# EAGLE design hail (EAGLE 6.6.0)
AUTHOR: Branden Ghena; REV: A; TITLE: Hail

## Sheet 1 of 4
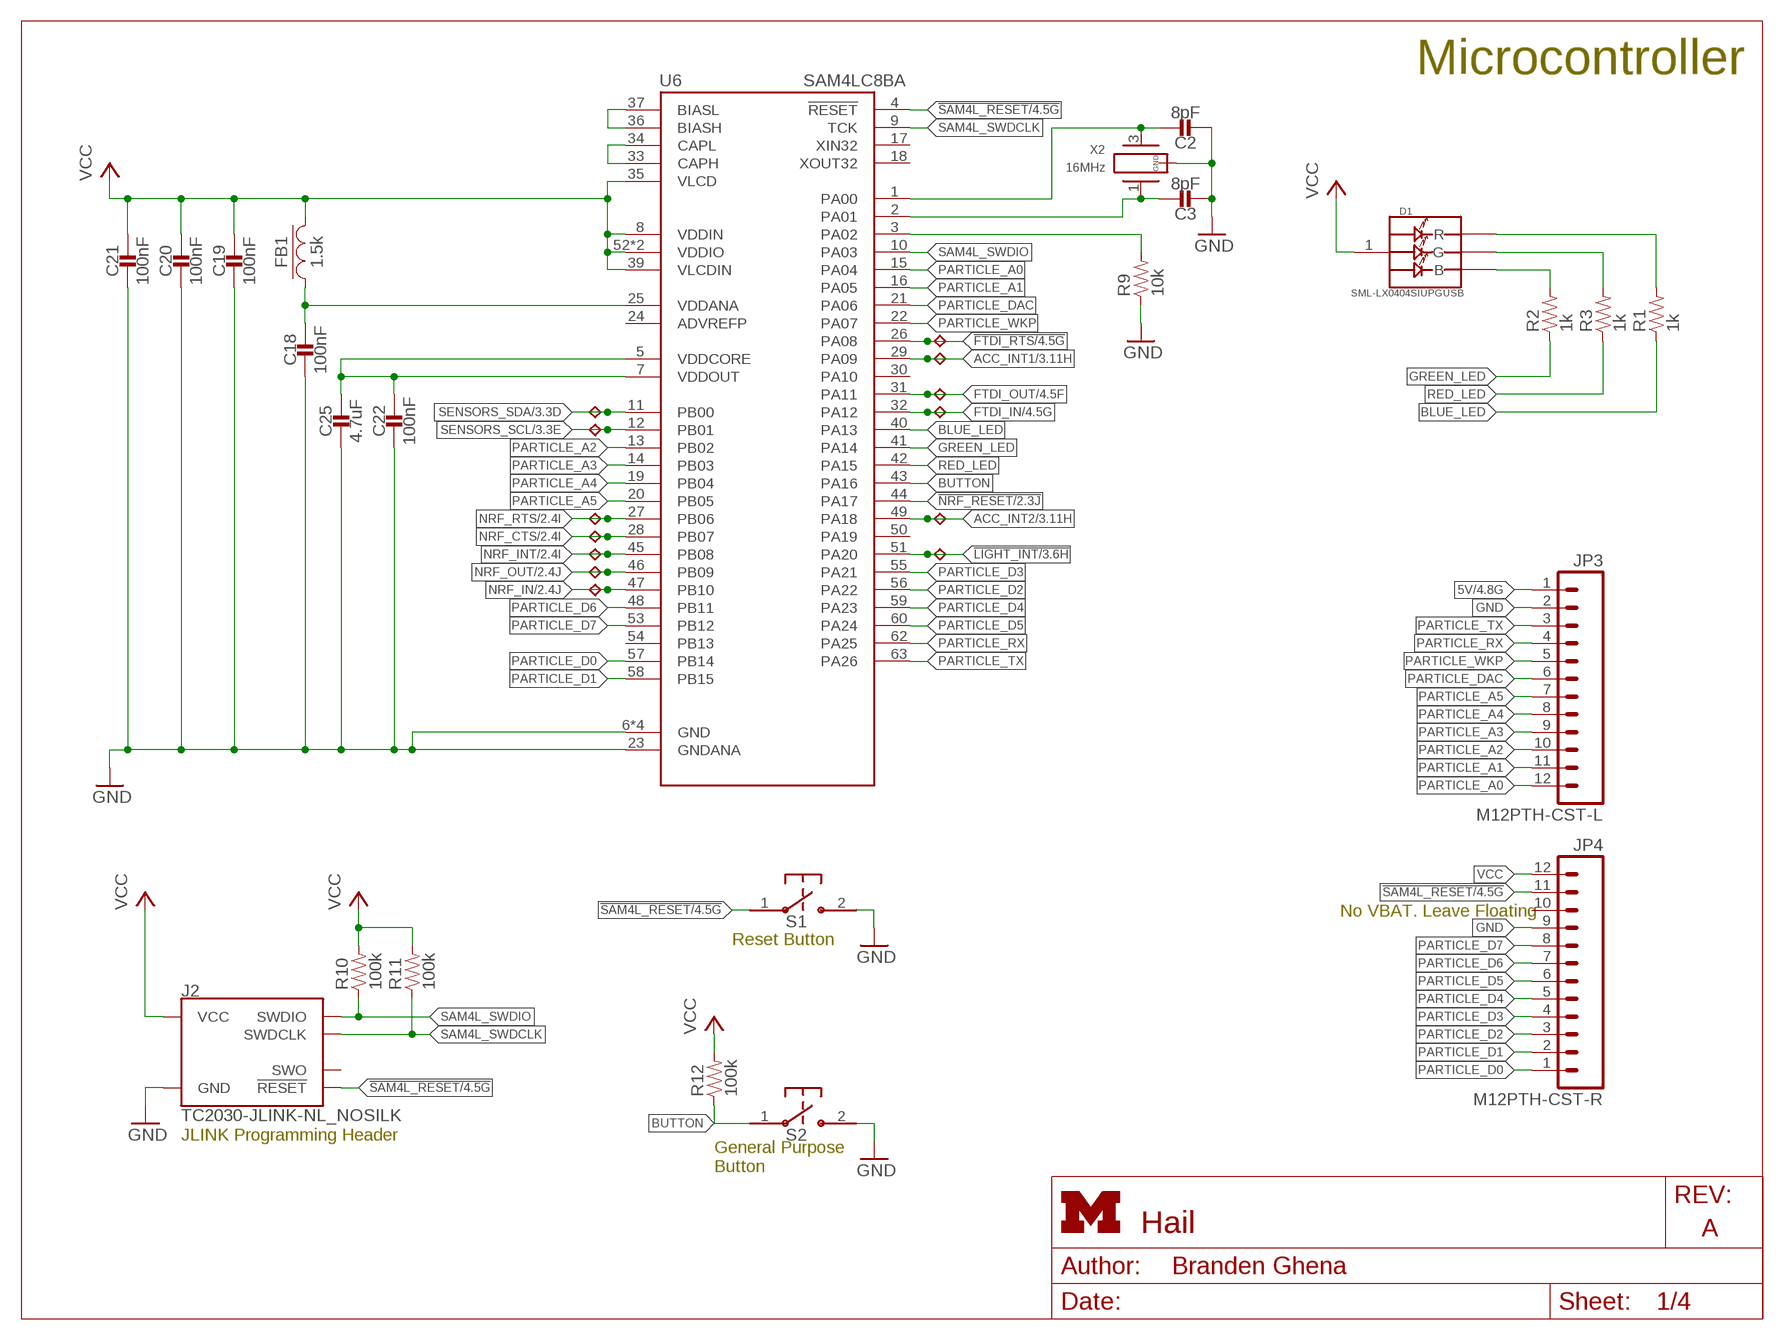
[diagram p0: schematic, sheet 1]
FRAME4 (LETTER_L_UMICH): HEIGHT: 8.5in; WIDTH: 11in
FRAME5 (LETTER_L_UMICH): HEIGHT: 8.5in; WIDTH: 11in

### Parts
C2  8pF  CAPACITOR0402_CAP  [0402_CAP]
C3  8pF  CAPACITOR0402_CAP  [0402_CAP]
C18  100nF  CAPACITOR0402_CAP  [0402_CAP]
C19  100nF  CAPACITOR0402_CAP  [0402_CAP]
C20  100nF  CAPACITOR0402_CAP  [0402_CAP]
C21  100nF  CAPACITOR0402_CAP  [0402_CAP]
C22  100nF  CAPACITOR0402_CAP  [0402_CAP]
C25  4.7uF  CAPACITOR0402_CAP  [0402_CAP]
D1  SML-LX0404SIUPGUSB  [1MM_SQ_4PAD]
FB1  1.5k  FERRITE_BEAD0402  [0402_CAP]
J2  TC2030-JLINK-NL_NOSILK  [TC2030-IDC-NL_NOSILK]
JP3  M12PTH-CST-L  [1X12-CASTELLATED]
JP4  M12PTH-CST-R  [1X12-CASTELLATED]
R1  1k  RESISTOR0402_RES  [0402_RES]
R2  1k  RESISTOR0402_RES  [0402_RES]
R3  1k  RESISTOR0402_RES  [0402_RES]
R9  10k  RESISTOR0402_RES  [0402_RES]
R10  100k  RESISTOR0402_RES  [0402_RES]
R11  100k  RESISTOR0402_RES  [0402_RES]
R12  100k  RESISTOR0402_RES  [0402_RES]
S1  B3U-1000P  [B3U-1000P]
S2  B3U-1000P  [B3U-1000P]
TP1  TPB1,27  [B1,27]
TP2  TPB1,27  [B1,27]
TP3  TPB1,27  [B1,27]
TP4  TPB1,27  [B1,27]
TP5  TPB1,27  [B1,27]
TP6  TPB1,27  [B1,27]
TP7  TPB1,27  [B1,27]
TP8  TPB1,27  [B1,27]
TP9  TPB1,27  [B1,27]
TP10  TPB1,27  [B1,27]
TP11  TPB1,27  [B1,27]
TP12  TPB1,27  [B1,27]
TP13  TPB1,27  [B1,27]
U6  SAM4LC8BA  [QFN-64-9MM]
X2  16MHz  FH1600015  [FHXXX]

### Nets
5V: JP3.1 ; also sheet 4
!FTDI_RTS: TP11.TP U6.26(PA08) ; also sheet 4
!LIGHT_INT: TP10.TP U6.51(PA20) ; also sheet 3
!NRF_RESET: U6.44(PA17) ; also sheet 2
!SAM4L_RESET: J2.3(!RESET) JP4.11 S1.1 U6.4(!RESET) ; also sheet 4
ACC_INT1: TP8.TP U6.29(PA09) ; also sheet 3
ACC_INT2: TP9.TP U6.49(PA18) ; also sheet 3
BLUE_LED: R1.1 U6.40(PA13)
BUCK/LDO_N1: R9.2 U6.3(PA02)
BUTTON: R12.1 S2.1 U6.43(PA16)
FTDI_IN: TP13.TP U6.32(PA12) ; also sheet 4
FTDI_OUT: TP12.TP U6.31(PA11) ; also sheet 4
GND: C2.2 C3.2 C18.2 C19.2 C20.2 C21.2 C22.2 C25.2 J2.5(GND) JP3.2 JP4.9 R9.1 S1.2 S2.2 U6.6(GND) U6.23(GNDANA) U6.38(GND) U6.64(GND) U6.GND X2.2(GND) X2.4(GND) ; also sheet 2,3,4
GREEN_LED: R2.1 U6.41(PA14)
N$7: D1.3(B) R2.2
N$8: D1.4(G) R3.2
N$9: D1.2(R) R1.2
N$15: U6.36(BIASH) U6.37(BIASL)
N$18: U6.33(CAPH) U6.34(CAPL)
N$20: C18.1 FB1.1 U6.25(VDDANA)
N$22: C22.1 C25.1 U6.5(VDDCORE) U6.7(VDDOUT)
NRF_CTS: TP2.TP U6.28(PB07) ; also sheet 2
NRF_IN: TP5.TP U6.47(PB10) ; also sheet 2
NRF_INT: TP3.TP U6.45(PB08) ; also sheet 2
NRF_OUT: TP4.TP U6.46(PB09) ; also sheet 2
NRF_RTS: TP1.TP U6.27(PB06) ; also sheet 2
PARTICLE_A0: JP3.12 U6.15(PA04)
PARTICLE_A1: JP3.11 U6.16(PA05)
PARTICLE_A2: JP3.10 U6.13(PB02)
PARTICLE_A3: JP3.9 U6.14(PB03)
PARTICLE_A4: JP3.8 U6.19(PB04)
PARTICLE_A5: JP3.7 U6.20(PB05)
PARTICLE_D0: JP4.1 U6.57(PB14)
PARTICLE_D1: JP4.2 U6.58(PB15)
PARTICLE_D2: JP4.3 U6.56(PA22)
PARTICLE_D3: JP4.4 U6.55(PA21)
PARTICLE_D4: JP4.5 U6.59(PA23)
PARTICLE_D5: JP4.6 U6.60(PA24)
PARTICLE_D6: JP4.7 U6.48(PB11)
PARTICLE_D7: JP4.8 U6.53(PB12)
PARTICLE_DAC: JP3.6 U6.21(PA06)
PARTICLE_RX: JP3.4 U6.62(PA25)
PARTICLE_TX: JP3.3 U6.63(PA26)
PARTICLE_WKP: JP3.5 U6.22(PA07)
RED_LED: R3.1 U6.42(PA15)
SAM4L_SWDCLK: J2.4(SWDCLK) R11.1 U6.9(TCK)
SAM4L_SWDIO: J2.2(SWDIO) R10.1 U6.10(PA03)
SAM4L_XIN1: C2.1 U6.1(PA00) X2.3
SAM4L_XOUT1: C3.1 U6.2(PA01) X2.1
SENSORS_SCL: TP7.TP U6.12(PB01) ; also sheet 3
SENSORS_SDA: TP6.TP U6.11(PB00) ; also sheet 3
VCC: C19.1 C20.1 C21.1 D1.1(VDD) FB1.2 J2.1(VCC) JP4.12 R10.2 R11.2 R12.2 U6.8(VDDIN) U6.35(VLCD) U6.39(VLCDIN) U6.52(VDDIO) U6.61(VDDIO) ; also sheet 2,3,4
Unconnected: J2.6(SWO) JP4.10 U6.17(XIN32) U6.18(XOUT32) U6.30(PA10) U6.50(PA19) U6.54(PB13)

### Notes on the sheet
- Microcontroller
- No VBAT. Leave Floating
- Reset Button
- JLINK Programming Header
- General Purpose
  Button

## Sheet 2 of 4
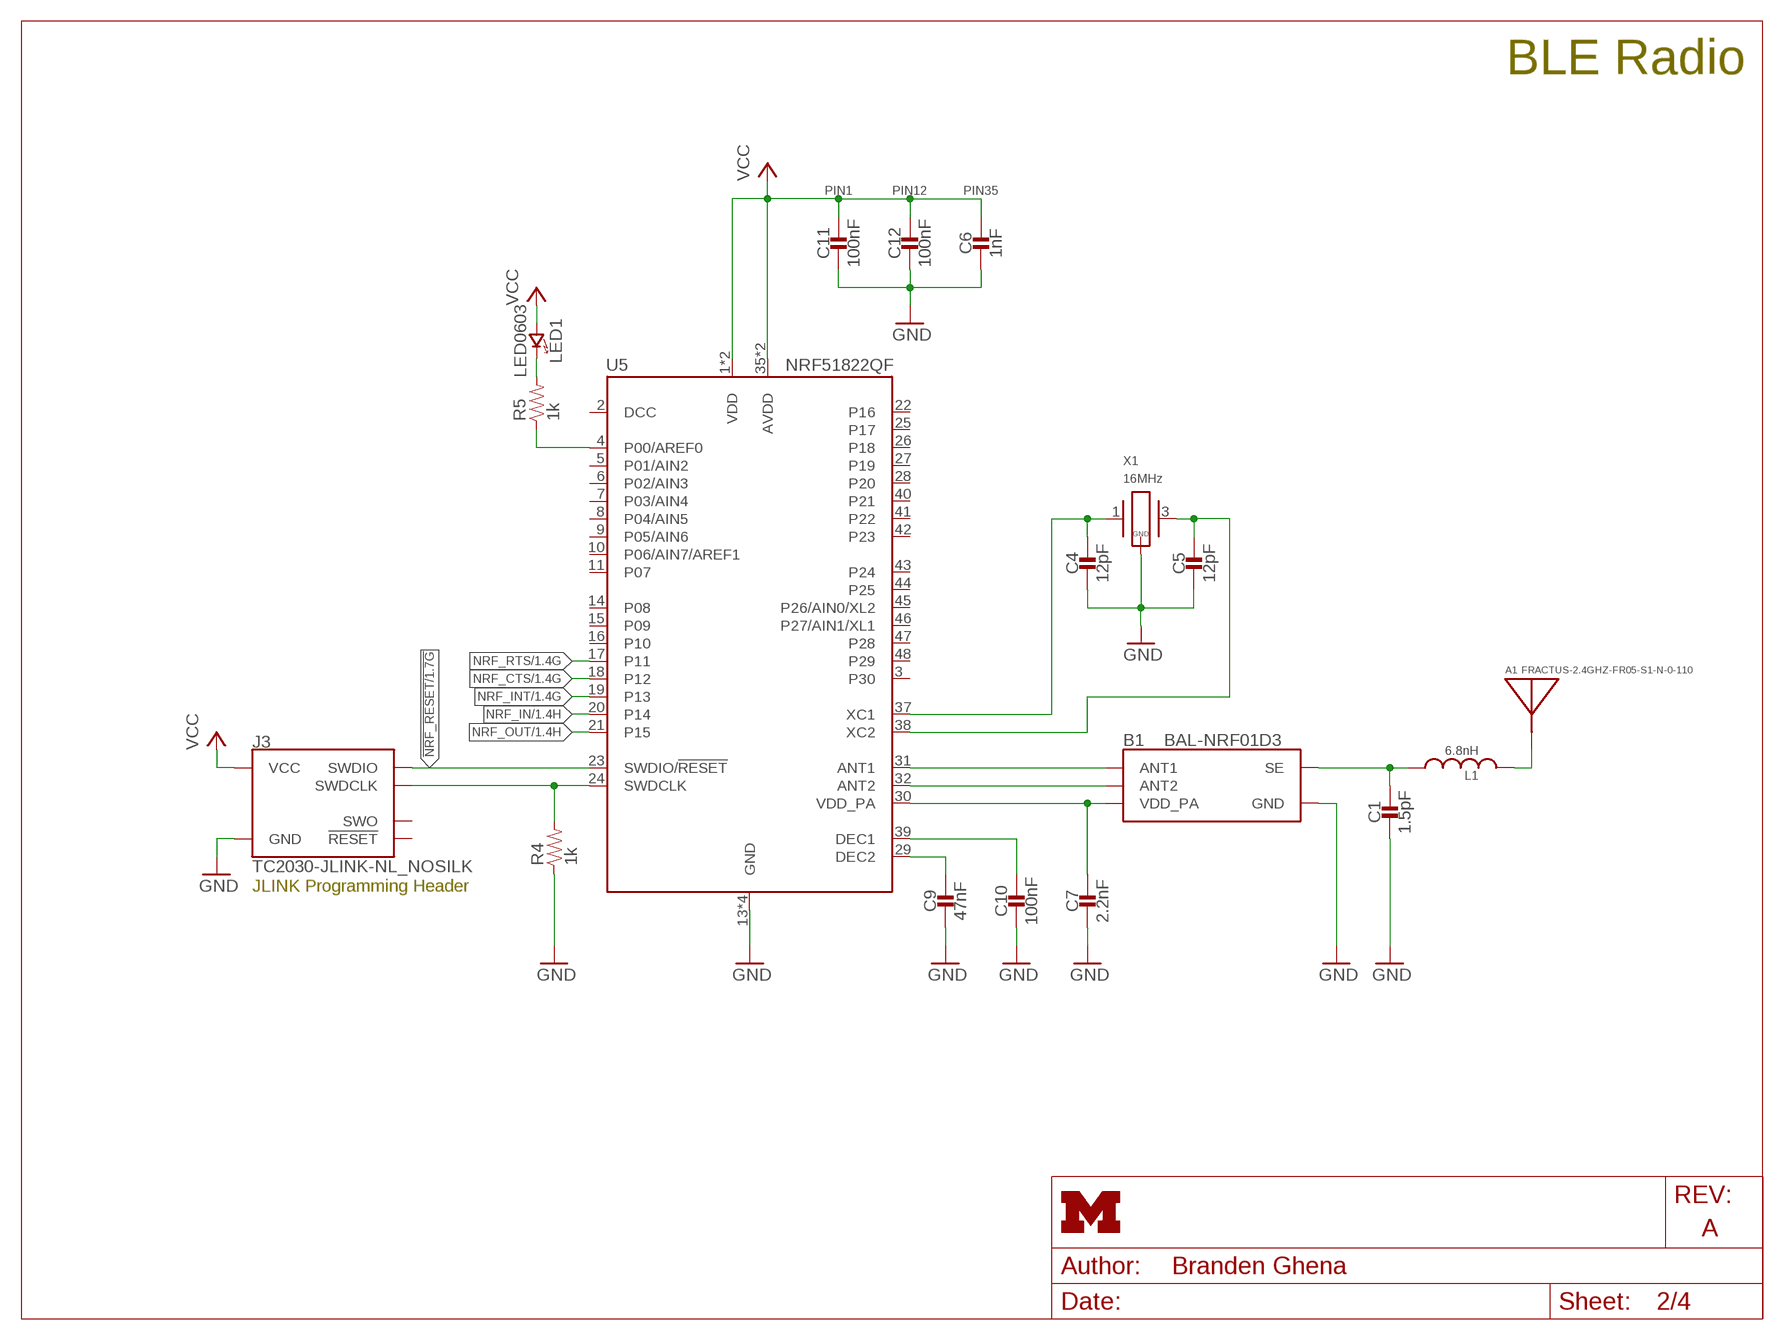
[diagram p1: schematic, sheet 2]
FRAME2 (LETTER_L_UMICH): HEIGHT: 8.5in; WIDTH: 11in
FRAME3 (LETTER_L_UMICH): HEIGHT: 8.5in; TITLE: Hail; WIDTH: 11in

### Parts
A1  FRACTUS-2.4GHZ-FR05-S1-N-0-110  [FRACTUS-ANTENNA-FR05-S1-N-0-110]
B1  BAL-NRF01D3  [BAL-NRF01D3]
C1  1.5pF  CAPACITOR0402_CAP  [0402_CAP]
C4  12pF  CAPACITOR0402_CAP  [0402_CAP]
C5  12pF  CAPACITOR0402_CAP  [0402_CAP]
C6  1nF  CAPACITOR0402_CAP  [0402_CAP]
C7  2.2nF  CAPACITOR0402_CAP  [0402_CAP]
C9  47nF  CAPACITOR0402_CAP  [0402_CAP]
C10  100nF  CAPACITOR0402_CAP  [0402_CAP]
C11  100nF  CAPACITOR0402_CAP  [0402_CAP]
C12  100nF  CAPACITOR0402_CAP  [0402_CAP]
J3  TC2030-JLINK-NL_NOSILK  [TC2030-IDC-NL_NOSILK]
L1  6.8nH  INDUCTOR0402  [0402_CAP]
LED1  LED0603  [LED-0603]
R4  1k  RESISTOR0402_RES  [0402_RES]
R5  1k  RESISTOR0402_RES  [0402_RES]
U5  NRF51822QF  [QFN-48-6MM]
X1  16MHz  TXC-8Y  [TXC-8Y]

### Nets
!NRF_RESET: J3.2(SWDIO) U5.23(SWDIO/!RESET) ; also sheet 1
GND: B1.GND C1.2 C4.2 C5.2 C6.2 C7.2 C9.2 C10.2 C11.2 C12.2 J3.5(GND) R4.1 U5.13(GND) U5.33(GND) U5.34(GND) U5.GND X1.2(GND) X1.4(GND) ; also sheet 1,3,4
N$3: C10.1 U5.39(DEC1)
N$4: C9.1 U5.29(DEC2)
N$6: J3.4(SWDCLK) R4.2 U5.24(SWDCLK)
N$10: R5.1 U5.4(P00/AREF0)
N$11: LED1.C(CATHODE) R5.2
N$12: B1.ANT1 U5.31(ANT1)
N$13: B1.VCC(VDD_PA) C7.1 U5.30(VDD_PA)
N$14: B1.ANT2 U5.32(ANT2)
N$16: C4.1 U5.37(XC1) X1.1
N$17: C5.1 U5.38(XC2) X1.3
N$19: B1.SE C1.1 L1.1
N$21: A1.ANT(ANTENNA) L1.2
NRF_CTS: U5.18(P12) ; also sheet 1
NRF_IN: U5.20(P14) ; also sheet 1
NRF_INT: U5.19(P13) ; also sheet 1
NRF_OUT: U5.21(P15) ; also sheet 1
NRF_RTS: U5.17(P11) ; also sheet 1
VCC: C6.1 C11.1 C12.1 J3.1(VCC) LED1.A(ANODE) U5.1(VDD) U5.12(VDD) U5.35(AVDD) U5.36(AVDD) ; also sheet 1,3,4
Unconnected: J3.3(!RESET) J3.6(SWO) U5.2(DCC) U5.3(P30) U5.5(P01/AIN2) U5.6(P02/AIN3) U5.7(P03/AIN4) U5.8(P04/AIN5) U5.9(P05/AIN6) U5.10(P06/AIN7/AREF1) U5.11(P07) U5.14(P08) U5.15(P09) U5.16(P10) U5.22(P16) U5.25(P17) U5.26(P18) U5.27(P19) U5.28(P20) U5.40(P21) U5.41(P22) U5.42(P23) U5.43(P24) U5.44(P25) U5.45(P26/AIN0/XL2) U5.46(P27/AIN1/XL1) U5.47(P28) U5.48(P29)

### Notes on the sheet
- BLE Radio
- PIN1 | PIN12 | PIN35
- JLINK Programming Header

## Sheet 3 of 4
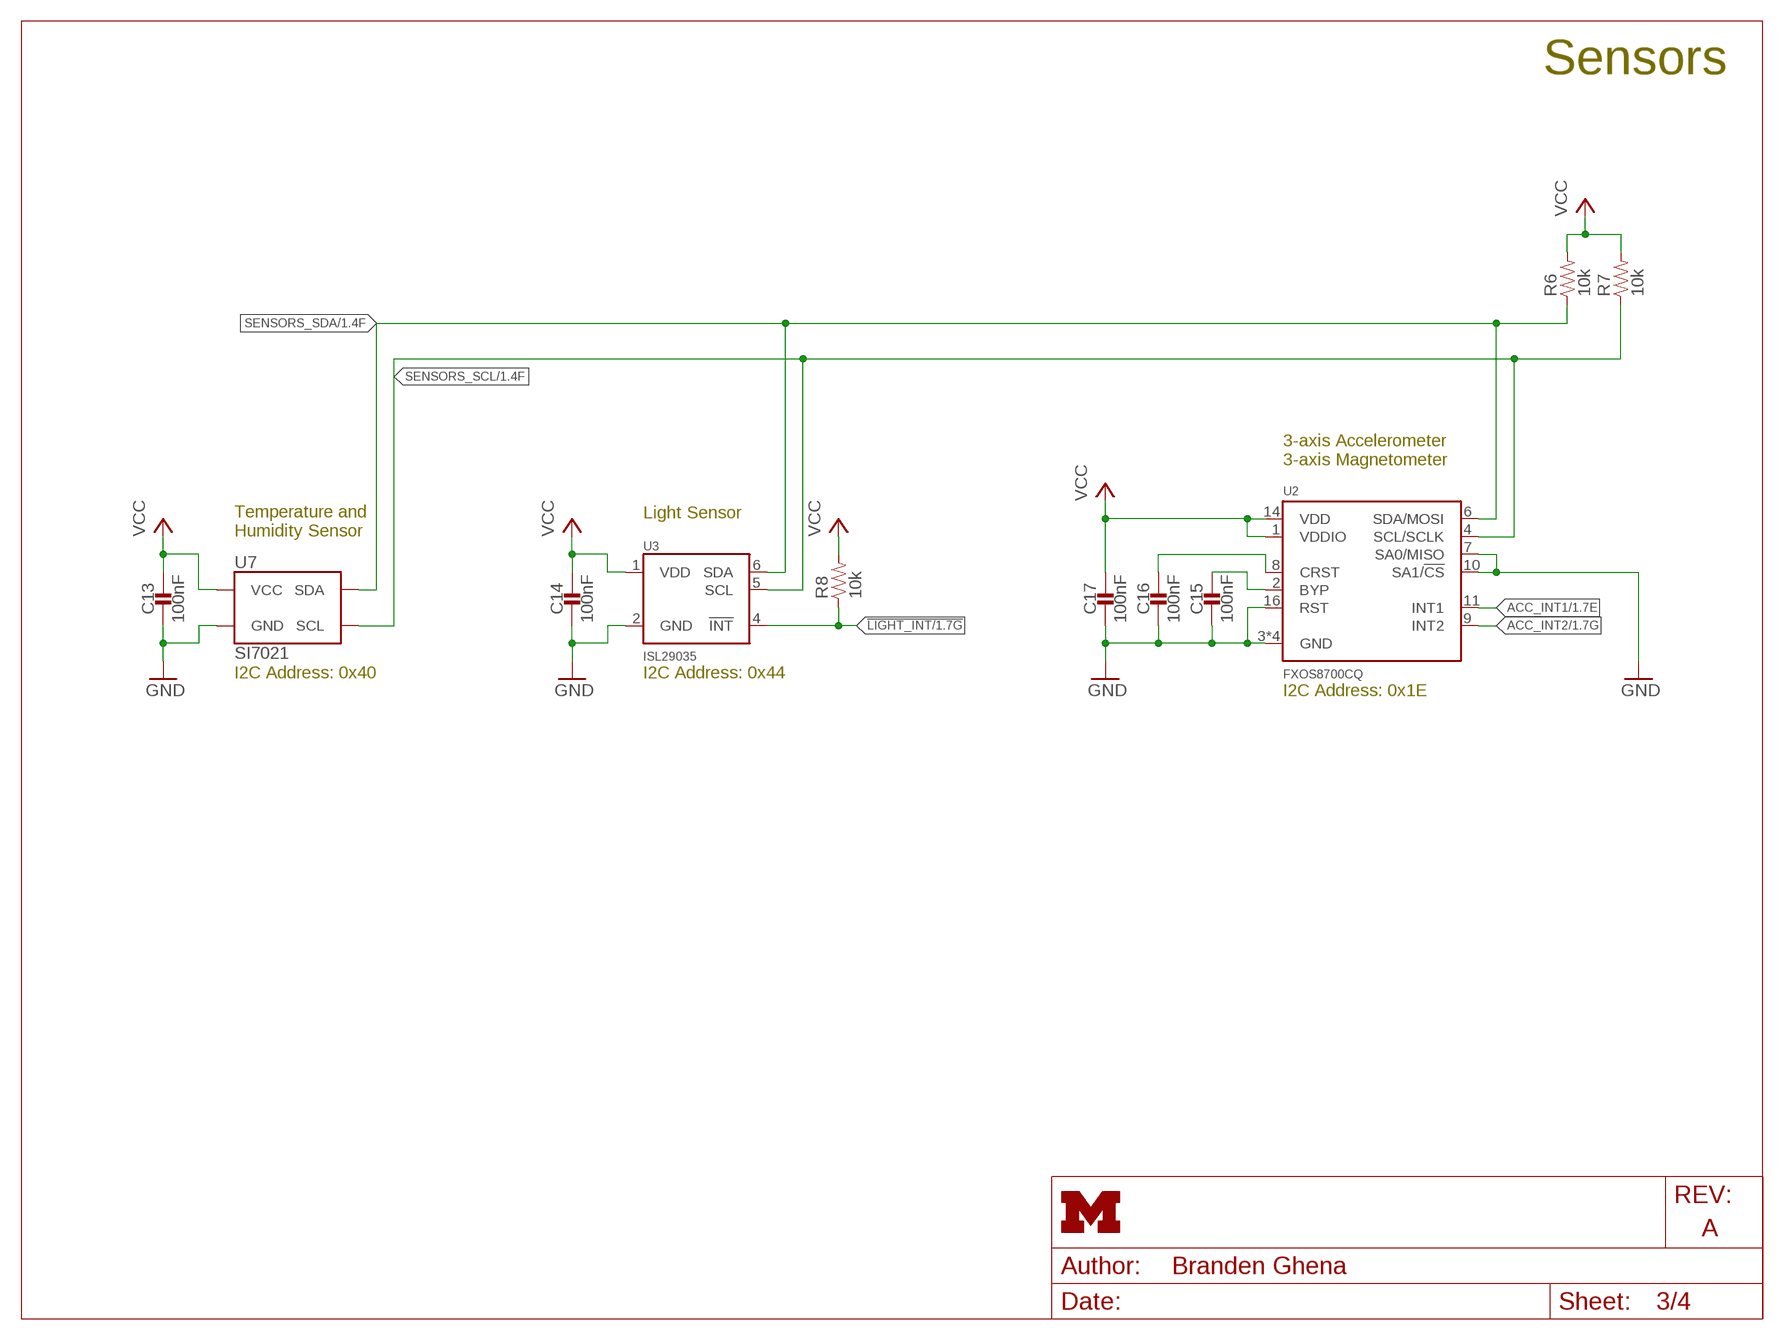
[diagram p2: schematic, sheet 3]
FRAME6 (LETTER_L_UMICH): HEIGHT: 8.5in; TITLE: Hail; WIDTH: 11in

### Parts
C13  100nF  CAPACITOR0402_CAP  [0402_CAP]
C14  100nF  CAPACITOR0402_CAP  [0402_CAP]
C15  100nF  CAPACITOR0402_CAP  [0402_CAP]
C16  100nF  CAPACITOR0402_CAP  [0402_CAP]
C17  100nF  CAPACITOR0402_CAP  [0402_CAP]
R6  10k  RESISTOR0402_RES  [0402_RES]
R7  10k  RESISTOR0402_RES  [0402_RES]
R8  10k  RESISTOR0402_RES  [0402_RES]
U2  FXOS8700CQ  [QFN-16-3MM]
U3  ISL29035  [ODFN-6-1.5MMX1.6MM]
U7  SI7021  [DFN-6/3MM]

### Nets
!LIGHT_INT: R8.1 U3.4(!INT) ; also sheet 1
ACC_INT1: U2.11(INT1) ; also sheet 1
ACC_INT2: U2.9(INT2) ; also sheet 1
GND: C13.2 C14.2 C15.2 C16.2 C17.2 U2.3(GND) U2.5(GND) U2.7(SA0/MISO) U2.10(SA1/!CS) U2.12(GND) U2.13(GND) U2.16(RST) U3.2(GND) U7.2(GND) ; also sheet 1,2,4
N$26: C15.1 U2.2(BYP)
N$27: C16.1 U2.8(CRST)
SENSORS_SCL: R7.1 U2.4(SCL/SCLK) U3.5(SCL) U7.6(SCL) ; also sheet 1
SENSORS_SDA: R6.1 U2.6(SDA/MOSI) U3.6(SDA) U7.1(SDA) ; also sheet 1
VCC: C13.1 C14.1 C17.1 R6.2 R7.2 R8.2 U2.1(VDDIO) U2.14(VDD) U3.1(VDD) U7.5(VCC) ; also sheet 1,2,4

### Notes on the sheet
- Sensors
- 3-axis Accelerometer
  3-axis Magnetometer
- Light Sensor
- Temperature and
  Humidity Sensor
- I2C Address: 0x40 | I2C Address: 0x44
- I2C Address: 0x1E

## Sheet 4 of 4
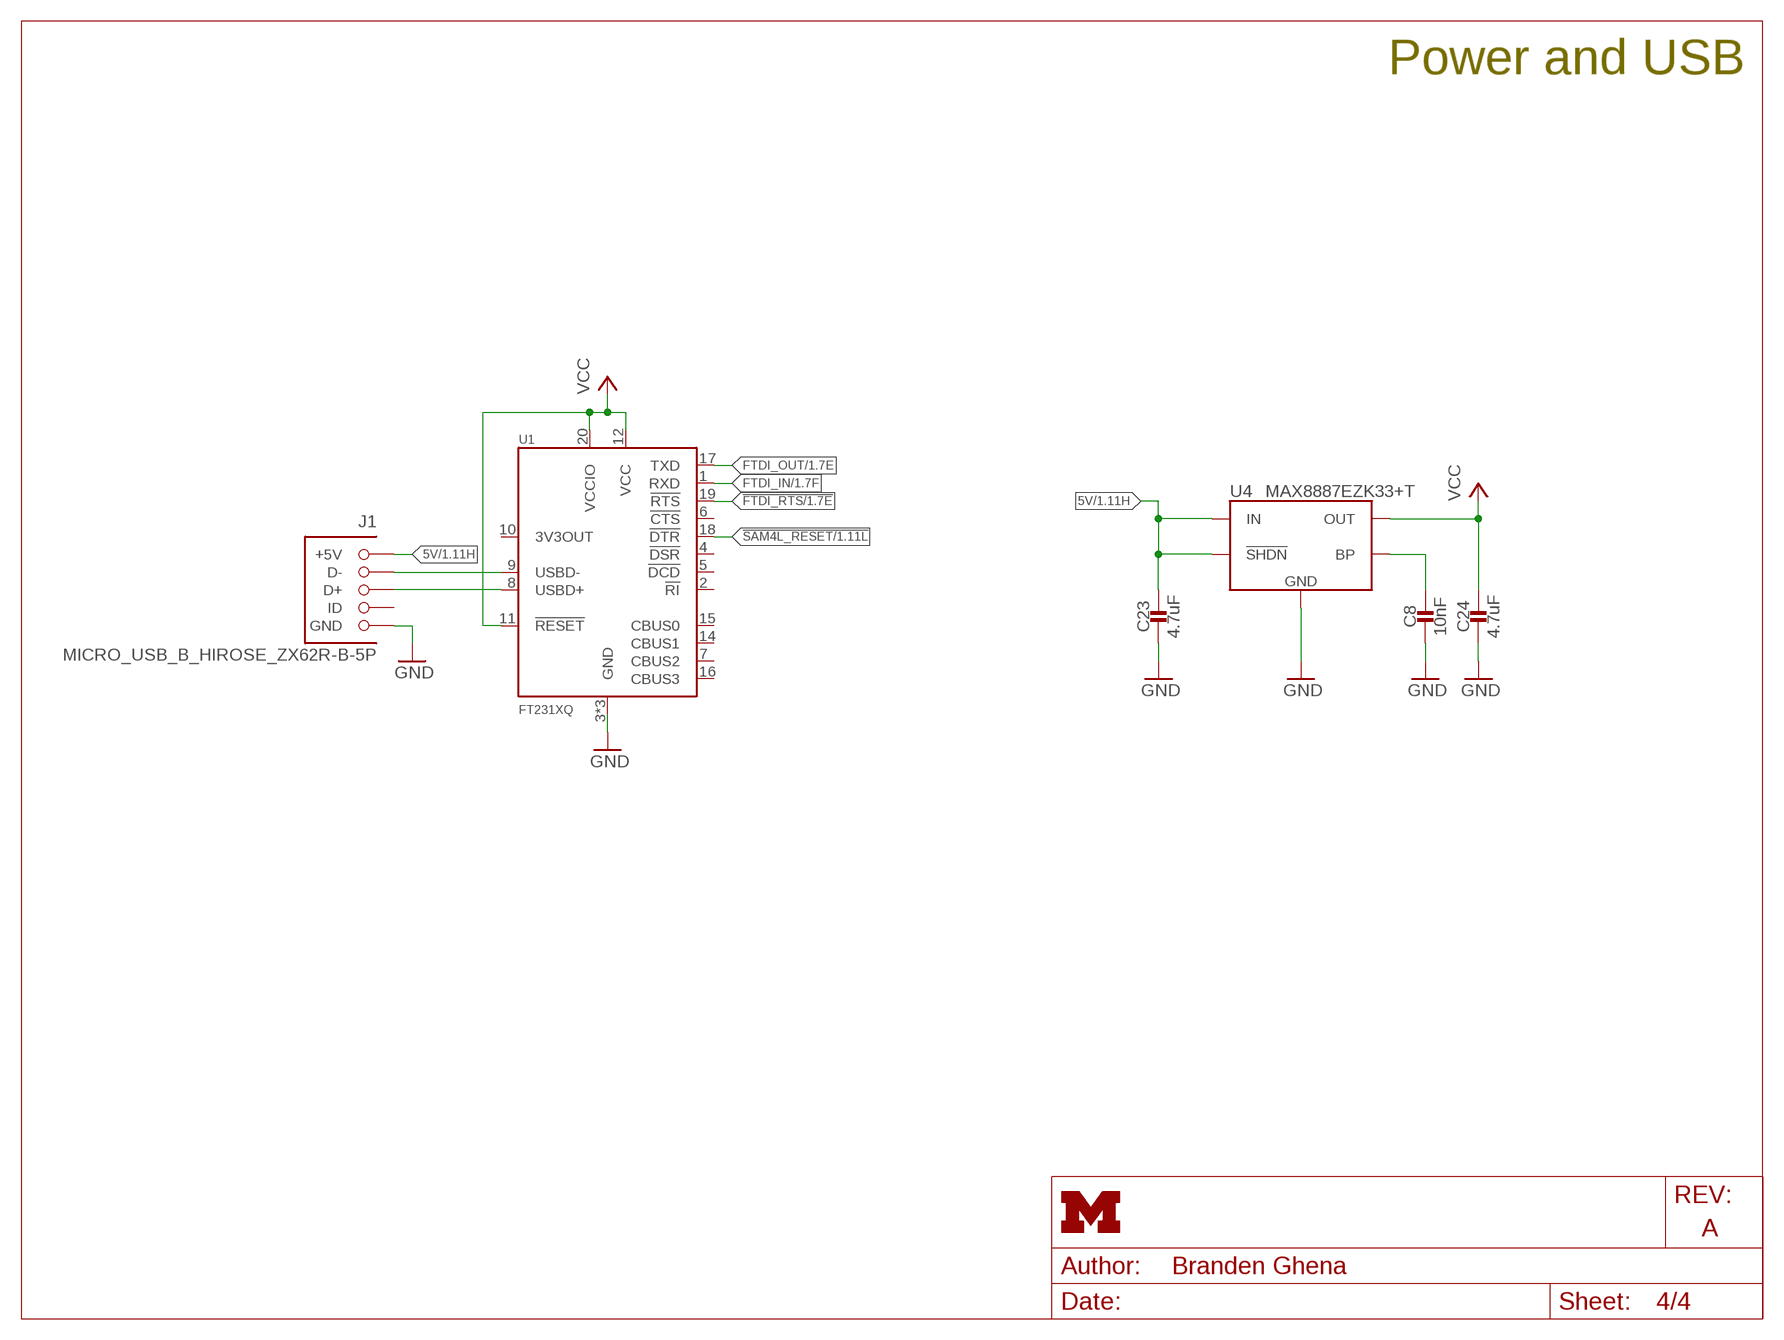
[diagram p3: schematic, sheet 4]
FRAME1 (LETTER_L_UMICH): HEIGHT: 8.5in; TITLE: Hail; WIDTH: 11in

### Parts
C8  10nF  CAPACITOR0402_CAP  [0402_CAP]
C23  4.7uF  CAPACITOR0402_CAP  [0402_CAP]
C24  4.7uF  CAPACITOR0402_CAP  [0402_CAP]
J1  MICRO_USB_B_HIROSE_ZX62R-B-5P  [USB_MICRO_B-HIROSE-ZX62R-B-5P]
U1  FT231XQ  [QFN-20-4MM]
U4  MAX8887EZK33+T  [SOT-23-5]

### Nets
5V: C23.1 J1.1(+5V) U4.1(IN) U4.3(!SHDN) ; also sheet 1
!FTDI_RTS: U1.19(!RTS) ; also sheet 1
!SAM4L_RESET: U1.18(!DTR) ; also sheet 1
FTDI_IN: U1.1(RXD) ; also sheet 1
FTDI_OUT: U1.17(TXD) ; also sheet 1
GND: C8.2 C23.2 C24.2 J1.5(GND) U1.3(GND) U1.13(GND) U1.GND U4.2(GND) ; also sheet 1,2,3
N$1: J1.2(D-) U1.9(USBD-)
N$2: J1.3(D+) U1.8(USBD+)
N$5: C8.1 U4.4(BP)
VCC: C24.1 U1.11(!RESET) U1.12(VCC) U1.20(VCCIO) U4.5(OUT) ; also sheet 1,2,3
Unconnected: J1.4(ID) U1.2(!RI) U1.4(!DSR) U1.5(!DCD) U1.6(!CTS) U1.7(CBUS2) U1.10(3V3OUT) U1.14(CBUS1) U1.15(CBUS0) U1.16(CBUS3)

### Notes on the sheet
- Power and USB

## Power pins joined to a net without a drawn wire
ADVREFP: U6.24(ADVREFP)

## Library data of the parts
A1 = chips:FRACTUS-2.4GHZ-FR05-S1-N-0-110: Fractus Micro Reach Xtend Requires matching network.; RICHARDSON_RFPD: FR05-S1-N-0110B
B1 = chips:BAL-NRF01D3: 50 ohm nominal input / conjugate match balun to nRF51422-QFAA, nRF24LE1, nRF51822-QFAA/AB, with integrated harmonic filter; DIGIKEY: 497-13637-1-ND; MOUSER: 511-BAL-NRF01D3
C1 = passives:CAPACITOR: 0402 Capacitor; DIGIKEY: 490-6212-1-ND
C2 C3 = passives:CAPACITOR: 0402 Capacitor; DIGIKEY: 490-8230-1-ND
C4 C5 = passives:CAPACITOR: 0402 Capacitor; DIGIKEY: 490-6197-1-ND
C6 = passives:CAPACITOR: 0402 Capacitor; DIGIKEY: 490-1303-1-ND
C7 = passives:CAPACITOR: 0402 Capacitor; DIGIKEY: 490-5419-1-ND
C8 = passives:CAPACITOR: 0402 Capacitor; DIGIKEY: 490-7763-1-ND
C9 = passives:CAPACITOR: 0402 Capacitor; DIGIKEY: 445-1264-1-ND
C10-C22 = passives:CAPACITOR: 0402 Capacitor; DIGIKEY: 490-10777-1-ND
C23-C25 = passives:CAPACITOR: 0402 Capacitor; DIGIKEY: 490-13252-1-ND
D1 = leds:SML-LX0404SIUPGUSB: 1mm^2 RGB LED; DIGIKEY: 67-2125-1-ND
FB1 = passives:FERRITE_BEAD; DIGIKEY: 490-5216-1-ND
J1 = connector:MICRO_USB_B_HIROSE_ZX62R-B-5P: USB Micro B Connector Rounded side is up.; DIGIKEY: H125274CT-ND
J2 J3 = connector:TC2030-JLINK
JP3 JP4 = Particle:M12: Header 12 Standard 12-pin 0.1" header. Use with straight break away headers (SKU : PRT-00116), right angle break away headers (PRT-00553), swiss pins (PRT-00743), machine pins (PRT-00117), and female headers (PRT-00115).
L1 = passives:INDUCTOR: A very specific inductor; DIGIKEY: 490-6840-1-ND
LED1 = leds:LED: LED; DIGIKEY: 160-1837-6-ND
R1-R5 = passives:RESISTOR: Resistor Basic schematic elements and footprints for 0603, 1206, and PTH resistors.; DIGIKEY: 1276-3430-1-ND
R6-R9 = passives:RESISTOR: Resistor Basic schematic elements and footprints for 0603, 1206, and PTH resistors.; DIGIKEY: 1276-3431-1-ND
R10-R12 = passives:RESISTOR: Resistor Basic schematic elements and footprints for 0603, 1206, and PTH resistors.; DIGIKEY: 1276-3432-1-ND
S1 S2 = switches:B3U: Switch; DIGIKEY: SW1020CT-ND
TP1-TP13 = testpad:TP: Test pad
U1 = chips:FT231X: USB Bridge, USB to UART USB 2.0 UART Interface; DIGIKEY: 768-1128-1-ND; MPN: FT231XQ-R
U2 = chips:FXOS8700CQ: Accelerometer, Magnetometer, 3 Axis Sensor, I2C/SPI; DIGIKEY: FXOS8700CQR1CT-ND; MPN: FXOS8700CQR1
U3 = chips:ISL29035: Optical Sensor Ambient 550nm I2C; DIGIKEY: ISL29035IROZ-T7CT-ND; MPN: ISL29035IROZ-T7
U4 = chips:MAX8887: IC REG LDO 3.3V 0.3A TSOT23-5; DIGIKEY: MAX8887EZK33+TCT-ND
U5 = chips:NRF51822: Multiprotocol Bluetooth® 4.0 low energy/2.4 GHz RF SoC; DIGIKEY: 1490-1049-1-ND
U6 = chips:SAM4LC8BA: SAM4L Microcontroller. 64QFN Package. 512 Flash.; DIGIKEY: ATSAM4LC8BA-MURCT-ND
U7 = chips:SI7021: IC TEMP SENSOR RH 2% DFN; DIGIKEY: 336-3141-ND
X1 = crystals:TXC-8Y: 2mmx1.6mm SMD Crystal; DIGIKEY: 887-2003-1-ND
X2 = crystals:FH1600015: Pericom Type FH 16 MHz 2.5 x 2.0 mm; DIGIKEY: FH1600015CT-ND

## Board
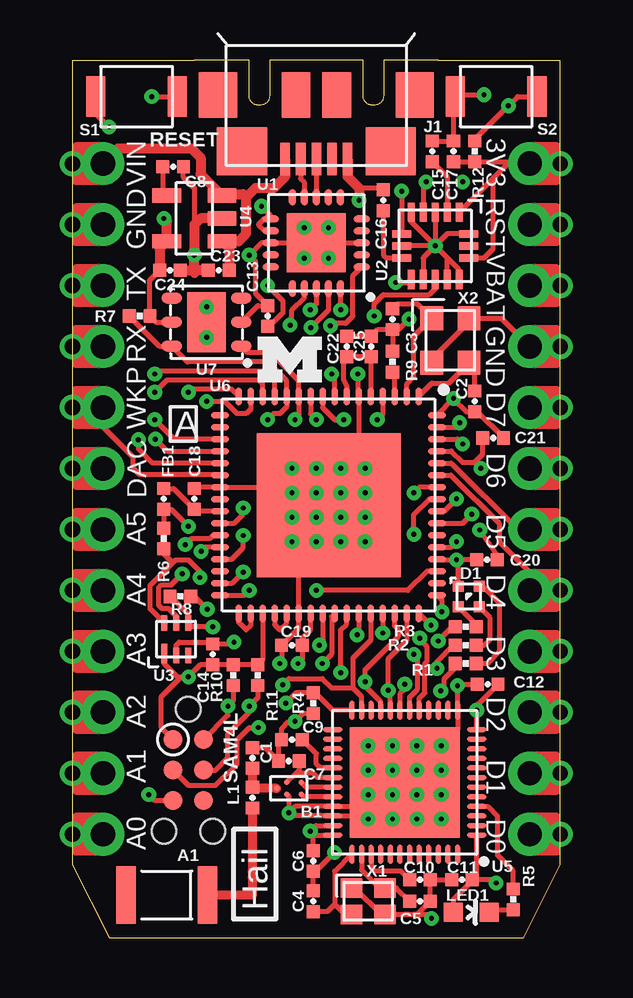
[diagram p4: board, top side]
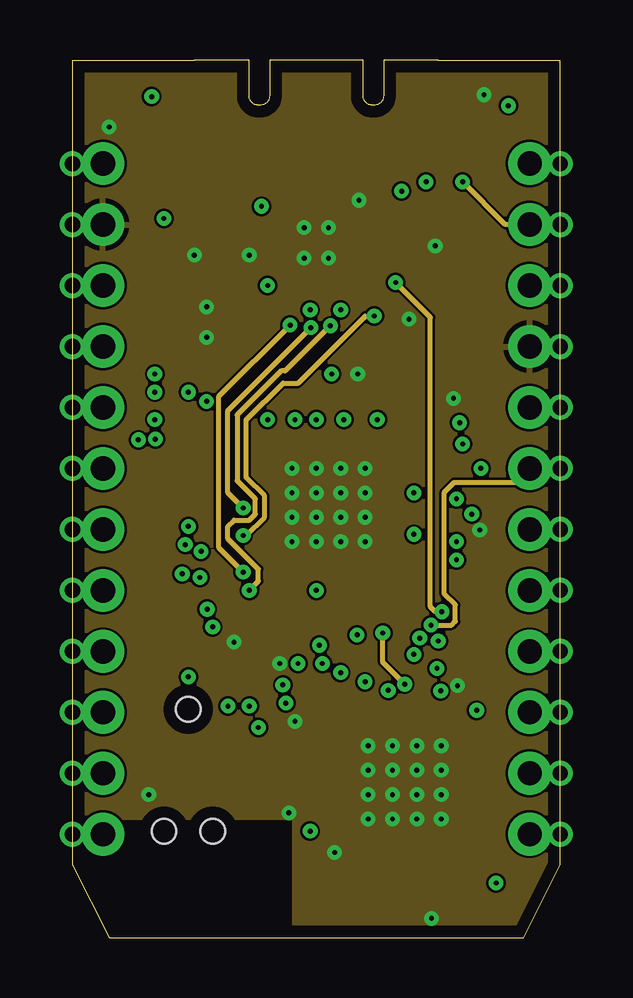
[diagram p5: board, inner layer Route2]
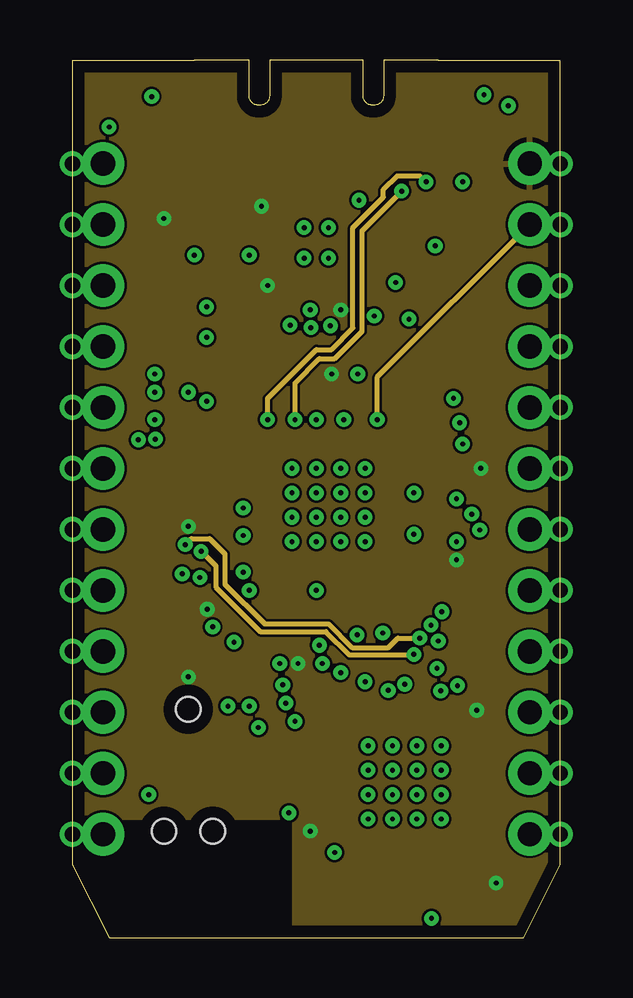
[diagram p6: board, inner layer Route15]
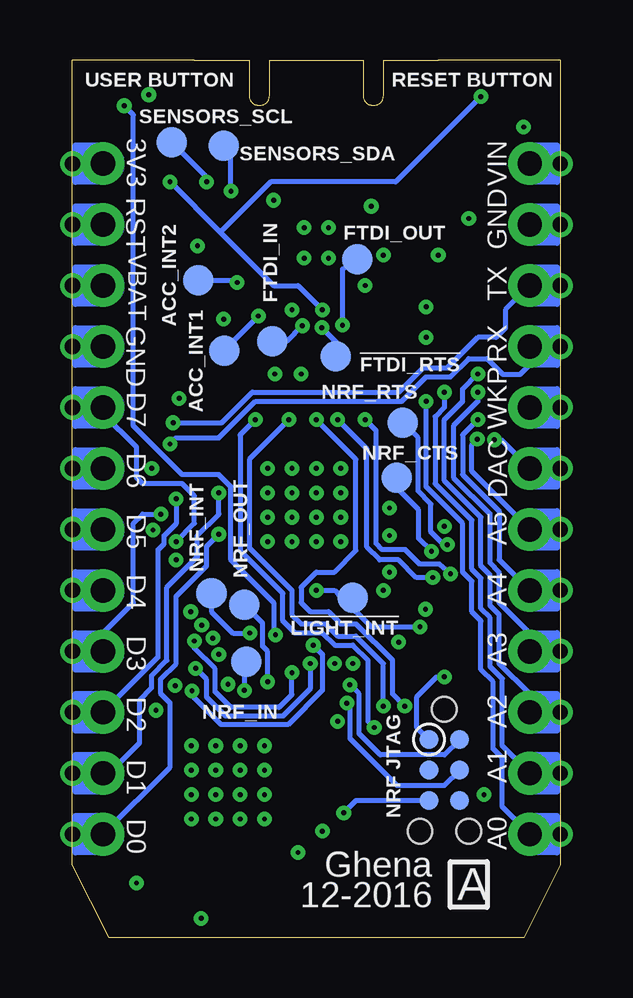
[diagram p7: board, bottom side, seen from below]

Size 20.32 x 36.58 mm. Coordinates in mm from the lower left corner, seen from the top.
Outline: 5.08,36.58 0,36.58 0,3.05 1.52,0 18.8,0 20.32,3.05 20.32,36.58 15.24,36.58
Copper layers (1+2*15+16): Top 0.0178mm / dielectric 12mil / Route2 0.0356mm / dielectric 28mil / Route15 0.0356mm / dielectric 12mil / Bottom 0.0178mm
Design rules "sunstone-4lyr_v1.0.0.3 *": minimum track width 4mil, minimum drill 8mil, track to track 4mil, track to pad 4mil, pad to pad 4mil, via to via 4mil, smd to smd 4mil, copper to edge 20mil, drill to drill 16mil, minimum pad ring 8mil, minimum via ring 8mil, stop-mask expansion 3mil, vias tented up to drill 50mil, thermal gap 8mil

### Footprints (pad centres in the part's own frame; a part is rotated, then mirrored left to right if it is on the bottom)
FRACTUS-ANTENNA-FR05-S1-N-0-110 = smd 0.8 x 2.4: ANT -1.7,0; NULL 1.7,0
BAL-NRF01D3 = smd 0.22 x 0.22: ANT1 -0.517,-0.25; ANT2 -0.517,0.25; GND 0.083,0.25; SE 0.516,0; VCC 0.083,-0.25
0402_CAP = smd 0.536 x 0.546: 1 -0.433,0; 2 0.433,0
1MM_SQ_4PAD = smd 0.457 x 0.457: 1 0.432,0.432; 2 0.432,-0.432; 3 -0.432,-0.432; 4 -0.432,0.432
USB_MICRO_B-HIROSE-ZX62R-B-5P = smd 0.4 x 1.35: 1 1.3,4.125; 2 0.65,4.125; 3 0,4.125; 4 -0.65,4.125; 5 -1.3,4.125 | smd 2.1 x 2: P$1 3.1,3.8; P$2 -3.1,3.8 | smd 1.6 x 1.9: P$3 -4.1,1.45; P$6 4.1,1.45 | smd 1.2 x 1.9: P$4 -0.85,1.45; P$5 0.85,1.45
TC2030-IDC-NL_NOSILK = smd 0.787 x 0.787: 1 -1.27,-0.635; 2 -1.27,0.635; 3 0,-0.635; 4 0,0.635; 5 1.27,-0.635; 6 1.27,0.635 | hole 1.016: -2.54,0; 2.54,1.016; 2.54,-1.016
1X12-CASTELLATED = drill 1.016 pad 1.778: 1 0,-13.97; 2 0,-11.43; 3 0,-8.89; 4 0,-6.35; 5 0,-3.81; 6 0,-1.27; 7 0,1.27; 8 0,3.81; 9 0,6.35; 10 0,8.89; 11 0,11.43; 12 0,13.97 | drill 0.635 pad 1.016: @1 1.27,-13.97; @2 1.27,-11.43; @3 1.27,-8.89; @4 1.27,-6.35; @5 1.27,-3.81; @6 1.27,-1.27; @7 1.27,1.27; @8 1.27,3.81; @9 1.27,6.35; @10 1.27,8.89; @11 1.27,11.43; @12 1.27,13.97
LED-0603 = smd 0.8 x 0.8: A 0,-0.75; C 0,0.75
0402_RES = smd 0.536 x 0.546: 1 -0.433,0; 2 0.433,0
B3U-1000P = smd 0.8 x 1.7: 1 -1.7,0; 2 1.7,0
B1,27 = smd 1.27 x 1.27: TP 0,0
QFN-20-4MM = smd 0.7 x 0.3: 1 -1.9,1; 2 -1.9,0.5; 3 -1.9,0; 4 -1.9,-0.5; 5 -1.9,-1; 11 1.9,-1; 12 1.9,-0.5; 13 1.9,0; 14 1.9,0.5; 15 1.9,1 | smd 0.3 x 0.7: 6 -1,-1.9; 7 -0.5,-1.9; 8 0,-1.9; 9 0.5,-1.9; 10 1,-1.9; 16 1,1.9; 17 0.5,1.9; 18 0,1.9; 19 -0.5,1.9; 20 -1,1.9 | smd 2.45 x 2.45: GND 0,0
QFN-16-3MM = smd 0.8 x 0.3: 1 -1.4,1; 2 -1.4,0.5; 3 -1.4,0; 4 -1.4,-0.5; 5 -1.4,-1; 9 1.4,-1; 10 1.4,-0.5; 11 1.4,0; 12 1.4,0.5; 13 1.4,1 | smd 0.3 x 0.8: 6 -0.5,-1.4; 7 0,-1.4; 8 0.5,-1.4; 14 0.5,1.4; 15 0,1.4; 16 -0.5,1.4
ODFN-6-1.5MMX1.6MM = smd 0.8 x 0.25: 1 -0.6,0.5 | smd 0.65 x 0.25: 2 -0.675,0; 3 -0.675,-0.5; 4 0.675,-0.5; 5 0.675,0; 6 0.675,0.5
SOT-23-5 = smd 0.6 x 1.2: 1 -0.95,-1.15; 2 0,-1.15; 3 0.95,-1.15; 4 0.95,1.15; 5 -0.95,1.15
QFN-48-6MM = smd 0.8 x 0.203: 1 -3,2.2; 2 -3,1.8; 3 -3,1.4; 4 -3,1; 5 -3,0.6; 6 -3,0.2; 7 -3,-0.2; 8 -3,-0.6; 9 -3,-1; 10 -3,-1.4; 11 -3,-1.8; 12 -3,-2.2; 25 3,-2.2; 26 3,-1.8; 27 3,-1.4; 28 3,-1; 29 3,-0.6; 30 3,-0.2; 31 3,0.2; 32 3,0.6; 33 3,1; 34 3,1.4; 35 3,1.8; 36 3,2.2 | smd 0.203 x 0.8: 13 -2.2,-3; 14 -1.8,-3; 15 -1.4,-3; 16 -1,-3; 17 -0.6,-3; 18 -0.2,-3; 19 0.2,-3; 20 0.6,-3; 21 1,-3; 22 1.4,-3; 23 1.8,-3; 24 2.2,-3; 37 2.2,3; 38 1.8,3; 39 1.4,3; 40 1,3; 41 0.6,3; 42 0.2,3; 43 -0.2,3; 44 -0.6,3; 45 -1,3; 46 -1.4,3; 47 -1.8,3; 48 -2.2,3 | smd 4.6 x 4.6: GND 0,0
QFN-64-9MM = smd 0.75 x 0.28: 1 -4.525,3.75; 2 -4.525,3.25; 3 -4.525,2.75; 4 -4.525,2.25; 5 -4.525,1.75; 6 -4.525,1.25; 7 -4.525,0.75; 8 -4.525,0.25; 9 -4.525,-0.25; 10 -4.525,-0.75; 11 -4.525,-1.25; 12 -4.525,-1.75; 13 -4.525,-2.25; 14 -4.525,-2.75; 15 -4.525,-3.25; 16 -4.525,-3.75; 33 4.525,-3.75; 34 4.525,-3.25; 35 4.525,-2.75; 36 4.525,-2.25; 37 4.525,-1.75; 38 4.525,-1.25; 39 4.525,-0.75; 40 4.525,-0.25; 41 4.525,0.25; 42 4.525,0.75; 43 4.525,1.25; 44 4.525,1.75; 45 4.525,2.25; 46 4.525,2.75; 47 4.525,3.25; 48 4.525,3.75 | smd 0.28 x 0.75: 17 -3.75,-4.525; 18 -3.25,-4.525; 19 -2.75,-4.525; 20 -2.25,-4.525; 21 -1.75,-4.525; 22 -1.25,-4.525; 23 -0.75,-4.525; 24 -0.25,-4.525; 25 0.25,-4.525; 26 0.75,-4.525; 27 1.25,-4.525; 28 1.75,-4.525; 29 2.25,-4.525; 30 2.75,-4.525; 31 3.25,-4.525; 32 3.75,-4.525; 49 3.75,4.525; 50 3.25,4.525; 51 2.75,4.525; 52 2.25,4.525; 53 1.75,4.525; 54 1.25,4.525; 55 0.75,4.525; 56 0.25,4.525; 57 -0.25,4.525; 58 -0.75,4.525; 59 -1.25,4.525; 60 -1.75,4.525; 61 -2.25,4.525; 62 -2.75,4.525; 63 -3.25,4.525; 64 -3.75,4.525 | smd 6 x 6: GND 0,0
DFN-6/3MM = smd 0.85 x 0.45: 1 -1.45,1; 2 -1.45,0; 3 -1.45,-1; 4 1.45,-1; 5 1.45,0; 6 1.45,1 | smd 1.6 x 2.5: P$1 0,0
TXC-8Y = smd 0.9 x 0.8: 1 -0.7,-0.55; 2 0.7,-0.55; 3 0.7,0.55; 4 -0.7,0.55
FHXXX = smd 1 x 0.95: 1 -0.925,-0.775; 2 0.925,-0.775; 3 0.925,0.775; 4 -0.925,0.775

### Placement (x,y rotation side)
A1  3.93,1.78 180 top
B1  9.02,6.22 180 top
C1  7.5,7.49 90 top
C2  16.76,22.35 270 top
C3  13.34,25.78 270 top
C4  10.03,1.52 90 top
C5  14.48,1.52 0 top
C6  10.03,3.2 270 top
C7  9.02,7.37 180 top
C8  4.19,32.13 0 top
C9  9.14,8.26 180 top
C10  14.48,2.41 0 top
C11  16.23,2.41 180 top
C12  17.3,10.57 180 top
C13  8.13,25.91 90 top
C14  5.84,11.81 90 top
C15  14.99,32.77 90 top
C16  12.95,30.73 90 top
C17  15.88,32.77 90 top
C18  5.08,18.29 90 top
C19  9.14,12.19 180 top
C20  17.27,15.75 0 top
C21  17.53,20.83 0 top
C22  11.43,24.64 90 top
C23  6.1,27.81 180 top
C24  4.06,27.81 0 top
C25  12.45,24.64 90 top
D1  16.51,14.22 90 top
FB1  3.81,18.29 270 top
J1  10.16,36.58 180 top
J2  4.83,6.99 270 top
J3  4.83,6.99 270 bottom
JP3  1.27,18.29 180 top
JP4  19.05,18.29 0 top
L1  7.5,5.84 270 top
LED1  16.61,1.07 270 top
R1  16.38,11.43 0 top
R2  16.38,12.19 0 top
R3  16.38,12.95 0 top
R4  10.03,9.78 90 top
R5  18.36,1.6 270 top
R6  3.81,16.64 90 top
R7  2.79,25.91 0 top
R8  4.5,14.22 0 top
R9  13.34,24 270 top
R10  6.71,10.95 90 top
R11  7.72,10.95 90 top
R12  16.76,32.77 270 top
S1  2.67,35.05 180 top
S2  17.65,35.05 180 top
TP1  6.55,21.46 0 bottom
TP2  6.81,19.18 0 bottom
TP3  14.53,14.35 0 bottom
TP4  13.16,13.87 0 bottom
TP5  13.08,11.51 0 bottom
TP6  14.02,32.99 0 bottom
TP7  16.18,33.15 0 bottom
TP8  14,24.46 0 bottom
TP9  15.09,27.41 0 bottom
TP10  8.64,14.17 0 bottom
TP11  9.35,24.23 0 bottom
TP12  8.46,28.27 0 bottom
TP13  11.99,24.87 0 bottom
U1  10.16,28.96 180 top
U2  15.11,28.83 270 top
U3  4.32,12.45 90 top
U4  5.08,29.97 90 top
U5  13.84,6.48 180 top
U6  10.67,18.03 270 top
U7  5.59,25.65 180 top
U$1  [PHOTON-BOTTOM-SS]  0,0.51 0 top
U$2  [PHOTON-TOP-SS]  0,0.51 0 top
U$3  [UMICH_SOLID_75MIL]  7.72,23.14 0 top
X1  12.32,1.52 0 top
X2  15.75,24.89 270 top

### Tracks (layer width: path | path; a pad name or v marks a point on that pad's centre or on a via)
5V
  Top 0.203: U4.3 6.3,30.99
  Top 0.406: J1.1 8.86,31.72 8.38,31.24 7.62,31.24 7.24,30.86 | 7.24,30.86 7.24,29.34 6.92,29.02 U4.1 6.53,28.72 C23.1 | JP3.1 1.91,32.89 4.95,32.89 5.33,32.51 5.33,31.82 U4.3 | 6.3,30.99 7.11,30.99 7.24,30.86
!FTDI_RTS  (via drill 0.2)
  Top 0.203: U6.26 6.74,17.28 7.11,17.65 v7.11,17.91 | U1.19 10.66,26.15 v9.93,25.43
  Route2 0.203: v7.11,17.91 6.48,18.54 6.48,21.97 8.64,24.13 v9.93,25.43
  Bottom 0.203: TP11.TP 9.35,24.84 v9.93,25.43
!LIGHT_INT  (via drill 0.2)
  Top 0.203: U6.51 14.78,15.28 13.97,14.48 v10.16,14.48 | v5.84,12.95 4.99,12.95 U3.4 4.82,13.47 R8.1
  Bottom 0.203: v10.16,14.48 9.4,14.48 9.22,14.3 9.09,14.17 | 9.09,14.17 7.87,12.95 v5.84,12.95 | TP10.TP 9.09,14.17
!NRF_RESET  (via drill 0.2)
  Top 0.203: v8.76,10.54 9.02,10.79 10.41,10.79 10.79,10.41 11.68,10.41 | U5.23 12.04,10.05 11.68,10.41 | U6.44 12.42,12.39 11.68,11.66 11.68,10.41
  Bottom 0.203: J3.2 4.83,7.62 7.5,7.62 8.38,8.51 8.38,10.16 v8.76,10.54
!SAM4L_RESET  (via drill 0.2)
  Top 0.203: 4.19,6.86 J2.3 4.83,6.35 5.95,6.35 6.86,7.25 6.86,8.26 7.37,8.76 v7.75,8.76 | U6.4 12.92,21.81 v12.7,21.59 | U1.18 10.16,26.42 v9.91,26.16 | v3.3,35.05 S1.1
  Route2 0.203: JP4.11 18.03,29.72 v16.26,31.5
  Route15 0.203: v12.7,21.59 12.7,23.37 JP4.11
  Bottom 0.203: v7.75,8.76 8,9.02 8,11.56 8.64,12.19 9.4,12.19 9.91,12.7 11.05,12.7 11.56,13.21 11.56,14.35 13.34,16.13 13.34,20.95 v12.7,21.59 | v16.26,31.5 14.16,29.4 | 14.16,29.4 11.94,27.18 10.92,27.18 v9.91,26.16 | v3.3,35.05 6.86,31.5 12.06,31.5 14.16,29.4
ACC_INT1  (via drill 0.2)
  Top 0.203: U6.29 6.64,15.78 7.11,16.26 v7.11,16.76 | v12.57,25.91 12.57,26.42 12.95,26.8 14.86,26.8 15.11,27.05 U2.11
  Route2 0.203: v7.11,16.76 7.24,16.76 8,17.53 8,18.41 7.24,19.18 7.24,21.58 8.77,23.11 9.4,23.11 12.19,25.91 v12.57,25.91
  Bottom 0.203: TP8.TP 13.99,24.49 v12.57,25.91
ACC_INT2  (via drill 0.2)
  Top 0.203: v13.46,27.3 13.99,27.3 U2.9 | U6.49 15.39,14.09 v15.39,13.59
  Route2 0.203: v13.46,27.3 14.91,25.86 14.91,13.79 15.11,13.59 v15.39,13.59
  Bottom 0.203: TP9.TP 13.56,27.41 v13.46,27.3
BLUE_LED  (via drill 0.2)
  Top 0.203: U6.40 10.42,12.32 v10.29,12.19 | v15.34,10.29 15.49,10.44 15.49,10.79 15.95,11.25 R1.1
  Bottom 0.203: v10.29,12.19 9.91,11.81 9.91,10.31 11.33,8.88 14.12,8.88 15.34,10.1 v15.34,10.29
BUCK/LDO_N1
  Top 0.203: U6.3 13.42,23.74 R9.2
BUTTON  (via drill 0.2)
  Top 0.203: U6.43 11.92,12.68 v11.86,12.62 | S2.1 18.54,35.05 v18.16,34.67 16.76,33.27 R12.1
  Bottom 0.203: v11.86,12.62 11.94,12.7 11.94,13.97 13.72,15.75 13.72,18.8 14.22,19.3 15.75,19.3 17.78,21.34 17.78,34.29 v18.16,34.67
FTDI_IN  (via drill 0.2)
  Top 0.203: U6.32 7.17,14.28 v7.37,14.48 | U1.1 11.68,27.58 11.68,25.91 11.38,25.6 10.85,25.6 v10.74,25.5
  Route2 0.203: v7.37,14.48 7.75,14.86 7.75,15.37 6.48,16.64 6.48,17.14 6.73,17.4 7.37,17.4 7.62,17.65 7.62,18.29 6.86,19.05 6.86,21.79 8.69,23.62 8.87,23.62 v10.74,25.5
  Bottom 0.203: TP13.TP 11.38,24.87 v10.74,25.5
FTDI_OUT  (via drill 0.2)
  Top 0.203: U6.31 6.66,14.78 v7.11,15.24 | U1.17 9.66,26.68 9.14,26.16 9.14,25.6 v9.07,25.53
  Route2 0.203: v7.11,15.24 6.1,16.26 6.1,22.55 v9.07,25.53
  Bottom 0.203: v9.07,25.53 9.07,27.86 TP12.TP
GND  (via drill 0.2)
  Top 0.203: U1.3 U1.GND U1.13 7.87,28.96 v7.37,28.45 7.62,28.19 7.62,26.85 C13.2 7.72,26.34 U7.2 | C3.2 R9.1 | U6.GND 11.92,19.28 U6.6 11.89,22.59 v11.89,23.5 | U6.GND 9.92,18.78 U6.23 5.14,18.78 C18.2 | U6.GND 9.42,16.78 U6.38 9.4,13.49 9.4,12.88 C19.2 8.71,11.51 v8.64,11.43 | X2.2 14.97,24.12 16.52,25.67 X2.4 17.87,25.82 JP4.9 19.05,24.2 | C22.2 C25.2 12.72,25.35 C3.2 | U6.64 15.88,22.47 | 15.88,22.47 v15.88,22.48 | 15.88,22.47 16.42,21.92 C2.2 16.87,21.92 C21.2 | U5.GND 12.84,5.48 U5.33 9.29,5.48 v9.02,5.21 | 9.14,5.08 v9.02,5.21 | U5.GND 12.44,5.08 U5.34 9.15,5.08 v9.02,5.21 | B1.GND 9.02,5.89 v9.02,5.21 | U5.GND 16.04,8.68 U5.13 v16.04,10.51 16.1,10.57 C12.2 | X1.4 11.77,2.07 12.87,0.97 X1.2 14.36,0.97 | R4.1 9.6,9.35 v9.27,9.02 9.02,9.02 8.71,8.71 C9.2 8.58,8.13 C7.2 8.02,7.93 C1.2 | 14.36,0.97 C5.2 C10.2 C11.2 | C20.2 17.7,15.95 v16.97,16.99 | C3.2 13.59,25.35 v14.02,25.78 | J2.5 3.43,5.71 v3.17,5.97 | U3.2 4.32,12.19 4.45,12.32 5.77,12.32 C14.2 6.66,12.24 v6.73,12.32 | 5.08,29.46 5.08,31.24 4.62,31.7 C8.2 | S1.2 0.97,34.34 v1.52,33.78 | U2.13 16.11,27.83 15.61,28.33 | 15.61,28.33 v15.11,28.83 | v15.11,28.83 U2.7 | U2.16 15.61,29.33 v15.11,28.83 | U2.3 v15.11,28.83 | U2.5 14.11,29.83 v15.11,28.83 | U2.12 15.61,28.33 | v15.11,28.83 14.61,28.33 U2.10 | C15.2 C17.2 15.88,34.97 S2.2 16.03,35.13 v17.14,35.13 | C16.2 12.88,31.24 11.94,31.24 | 14.36,0.97 14.8,0.97 v14.96,0.81 | C4.2 C6.2 10.13,2.77 v10.92,3.56
  Top 0.406: J1.5 11.46,31.72 11.94,31.24 v11.94,30.73 | U4.2 5.33,29.97 5.08,29.72 5.08,29.46 v5.08,28.45 5.08,27.94 | 5.08,27.94 5.08,27.71 5.19,27.81 C23.2 | C24.2 4.95,27.81 5.08,27.94
  Route2 0.203: v16.04,10.51
  Bottom 0.203: J3.5 8.51,5.71 v9.02,5.21
  other vias: 5.59,26.29 5.59,25.02 9.65,29.59 9.65,29.59 10.67,29.59 10.67,28.32 9.65,28.32 10.16,18.54 10.16,17.53 11.18,17.53 11.18,18.54 11.18,19.56 10.16,19.56 9.14,19.56 9.14,18.54 9.14,17.53 9.14,16.51 10.16,16.51 11.18,16.51 12.19,16.51 12.19,17.53 12.19,18.54 12.19,19.56 13.34,6.99 13.34,5.97 13.34,6.99 14.35,6.99 14.35,5.97 13.34,8 14.35,8 15.37,8 15.37,6.99 15.37,5.97 15.37,4.95 14.35,4.95 13.34,4.95 12.32,4.95 12.32,5.97 12.32,6.99 12.32,8
  pour Route2: 9.27,0 9.27,5 0,5 0,36.58 20.32,36.58 20.32,3.05 18.8,0
GREEN_LED  (via drill 0.2)
  Top 0.203: U6.41 10.79,13.39 10.79,11.81 v10.41,11.43 | v15.19,11.23 15.19,11.51 15.88,12.19 R2.1
  Bottom 0.203: v10.41,11.43 10.41,10.38 11.55,9.24 13.94,9.24 14.73,10.03 14.73,10.77 v15.19,11.23
N$1
  Top 0.203: J1.2 9.51,31.64 9.65,31.5 U1.9
N$2
  Top 0.203: J1.3 U1.8
N$3
  Top 0.203: C10.1 13.65,2.79 12.57,2.79 12.44,2.92 U5.39
N$4
  Top 0.203: U5.29 10.32,7.08 10.16,7.24 10.16,7.67 C9.1
N$5
  Top 0.203: 3.81,31.04 U4.4 3.76,31.09 C8.1
N$6  (via drill 0.2)
  Top 0.203: v8.89,9.78 9.32,10.21 R4.2 10.11,10.21 10.84,9.48 U5.24
  Bottom 0.203: J3.4 4.83,6.35 6.8,6.35 8.76,8.31 8.76,9.65 v8.89,9.78
N$7
  Top 0.203: R2.2 17.14,12.19 17.4,12.45 17.4,13.34 D1.3
N$8
  Top 0.203: D1.4 16.82,13.05 R3.2
N$9
  Top 0.203: D1.2 17.09,14.66 17.78,13.97 17.78,11.94 17.27,11.43 R1.2
N$10
  Top 0.203: R5.1 18.36,2.79 17.7,3.45 17.7,5.07 17.3,5.48 U5.4
N$11
  Top 0.203: LED1.C 17.46,1.17 R5.2
N$12
  Top 0.203: U5.31 9.73,6.28 B1.ANT1
N$13
  Top 0.203: U5.30 10.21,6.68 10.03,6.86 9.32,6.86 | 9.32,6.86 B1.VCC | C7.1 9.45,6.99 9.32,6.86
N$14
  Top 0.203: U5.32 9.63,5.88 B1.ANT2
N$15
  Top 0.203: U6.36 8.42,13.04 8.64,12.83 8.92,13.11 U6.37
N$16
  Top 0.203: U5.37 11.62,3.48 10.92,2.77 10.92,1.4 | 11.6,0.97 X1.1 11.35,0.97 10.92,1.4 | 10.92,1.4 10.62,1.09 C4.1
N$17
  Top 0.203: U5.38 12.04,2.82 12.79,2.07 X1.3 13.49,2.07 C5.1
N$18
  Top 0.203: U6.34 7.42,13.01 7.24,12.83 6.92,13.15 U6.33
N$19
  Top 0.381: B1.SE 7.5,6.22 L1.1 C1.1
N$20
  Top 0.203: U6.25 5.15,17.78 C18.1 4.21,18.72 FB1.1
N$21
  Top 0.381: L1.2 7.5,1.78 A1.ANT
N$22
  Top 0.203: U6.5 12.42,23.98 C25.1 C22.1 11.3,23.95 11.3,23.24 11.42,23 U6.7 11.42,22.87
N$26
  Top 0.203: C15.1 15.61,31.71 U2.2
N$27
  Top 0.203: C16.1 12.95,28.45 13.07,28.33 U2.8
NRF_CTS  (via drill 0.2)
  Top 0.203: U6.28 5.54,16.28 v5.36,16.1 | U5.18 14.04,10.03 14.38,10.36 14.38,11.66 v14.22,11.81
  Route15 0.203: v5.36,16.1 5.97,15.49 5.97,14.61 7.82,12.76 10.55,12.76 11.53,11.79 14.2,11.79 v14.22,11.81
  Bottom 0.203: v5.36,16.1 5.89,16.64 5.89,17.83 6.81,18.75 TP2.TP
NRF_IN  (via drill 0.2)
  Top 0.203: U6.47 13.92,12.39 13.16,11.63 v13.16,10.31 13.24,10.23 U5.20
  Bottom 0.203: TP5.TP 13.16,11.43 v13.16,10.31
NRF_INT  (via drill 0.2)
  Top 0.203: U6.45 12.92,12.71 v12.93,12.7 | v13.84,10.57 13.84,10.36 13.64,10.16 U5.19
  Route2 0.203: v13.84,10.57 12.93,11.48 v12.93,12.7
  Bottom 0.203: TP3.TP 14.53,13.59 13.64,12.7 v12.93,12.7
NRF_OUT  (via drill 0.2)
  Top 0.203: U6.46 13.42,13 13.59,12.83 13.59,12.57 12.19,11.18 v12.19,10.67 12.19,10.49 12.84,9.84 U5.21 12.84,9.76
  Bottom 0.203: v12.19,10.67 12.19,11.94 12.39,12.14 12.39,13.11 TP4.TP
NRF_RTS  (via drill 0.2)
  Top 0.203: v4.7,16.38 4.95,16.64 5.71,16.64 5.86,16.78 U6.27 | U5.17 14.44,9.97 14.68,10.21 14.68,11.43 14.76,11.51 14.76,12.14 14.47,12.43 v14.47,12.49
  Route15 0.203: v4.7,16.38 4.95,16.64 5.71,16.64 6.35,16 6.35,14.73 8,13.08 10.67,13.08 11.65,12.1 13.16,12.1 13.55,12.49 v14.47,12.49
  Bottom 0.203: v4.7,16.38 4.85,16.38 5.38,16.92 5.38,18.09 5.92,18.62 5.92,20.83 TP1.TP
PARTICLE_A0  (via drill 0.2)
  Top 0.203: v5.59,22.35 6.35,22.35 6.86,21.84 7.24,21.84 7.42,22.02 U6.15
  Bottom 0.203: JP3.12 2.41,5.46 2.41,7.49 2.79,7.87 2.79,10.67 3.3,11.18 3.3,13.21 3.68,13.59 3.68,14.86 4.06,15.24 4.06,17.27 5.59,18.8 v5.59,22.35
PARTICLE_A1  (via drill 0.2)
  Top 0.203: U6.16 6.62,22.86 4.95,22.86 v4.83,22.73
  Bottom 0.203: JP3.11 2.41,8 2.41,10.79 2.92,11.3 2.92,13.34 3.3,13.72 3.3,14.99 3.68,15.37 3.68,17.4 5.21,18.92 5.21,21.72 4.83,22.1 v4.83,22.73
PARTICLE_A2  (via drill 0.2)
  Top 0.203: v3.43,23.5 3.56,23.62 8,23.62 8.42,23.2 U6.13
  Bottom 0.203: JP3.10 1.27,10.16 2.54,11.43 2.54,13.46 2.92,13.84 2.92,15.11 3.3,15.49 3.3,17.53 4.83,19.05 4.83,21.59 4.06,22.35 4.06,22.86 v3.43,23.5
PARTICLE_A3  (via drill 0.2)
  Top 0.203: U6.14 7.92,23.07 7.75,23.24 3.94,23.24 v3.43,22.73
  Bottom 0.203: v3.43,22.73 3.43,22.35 4.45,21.34 4.45,19.18 2.92,17.65 2.92,15.62 2.54,15.24 2.54,13.97 1.27,12.7 JP3.9
PARTICLE_A4  (via drill 0.2)
  Top 0.203: U6.19 4.24,20.78 v3.43,21.59
  Bottom 0.203: v3.43,21.59 4.06,20.95 4.06,19.3 2.54,17.78 2.54,15.75 JP3.8
PARTICLE_A5  (via drill 0.2)
  Top 0.203: v3.45,20.78 3.95,20.28 U6.20
  Bottom 0.203: JP3.7 3.68,19.43 3.68,20.55 v3.45,20.78
PARTICLE_D0  (via drill 0.2)
  Top 0.203: U6.57 14.86,18.28 14.22,17.65 v14.22,16.82
  Bottom 0.203: JP4.1 16.26,7.11 16.26,9.78 16.64,10.16 16.64,10.79 16,11.43 16,14.22 14.73,15.49 14.73,16.31 v14.22,16.82
PARTICLE_D1  (via drill 0.2)
  Top 0.203: U6.58 14.47,18.78 v14.22,18.54
  Bottom 0.203: JP4.2 18.8,6.86 17.53,8.13 17.53,9.91 17.02,10.41 17.02,10.92 16.38,11.56 16.38,14.61 15.11,15.88 15.11,16.76 14.22,17.65 v14.22,18.54
PARTICLE_D2  (via drill 0.2)
  Top 0.203: U6.56 15.5,17.78 v16,18.29
  Bottom 0.203: JP4.3 16.76,11.68 16.76,16.15 16.51,16.41 16.51,16.74 16,17.25 v16,18.29
PARTICLE_D3  (via drill 0.2)
  Top 0.203: U6.55 16.27,17.28 v16.64,17.65
  Bottom 0.203: JP4.4 19.05,12.7 17.78,13.97 17.78,17.27 17.4,17.65 v16.64,17.65 16.89,17.65
PARTICLE_D4
  Top 0.203: U6.59 15.77,19.28 17.78,17.27 17.78,16.51 19.05,15.24 JP4.5
PARTICLE_D5
  Top 0.203: U6.60 15.78,19.78 18.54,17.02 JP4.6
PARTICLE_D6  (via drill 0.2)
  Top 0.203: U6.48 14.46,13.51 v14.94,13.03
  Route2 0.203: JP4.7 18.47,18.97 15.9,18.97 15.49,18.57 15.49,14.33 15.95,13.87 15.95,13.18 15.8,13.03 v14.94,13.03
PARTICLE_D7  (via drill 0.2)
  Top 0.203: U6.53 15.78,16.28 v16,16.51
  Bottom 0.203: v16,16.51 15.24,17.27 15.24,18.41 15.75,18.92 17.4,18.92 17.65,19.18 17.65,20.45 19.05,21.84 JP4.8 18.8,22.1
PARTICLE_DAC  (via drill 0.2)
  Top 0.203: U6.21 3.33,19.78 2.74,20.37 v2.74,20.75
  Bottom 0.203: JP3.6 2.46,20.75 v2.74,20.75
PARTICLE_RX  (via drill 0.2)
  Top 0.203: U6.62 16.05,20.78 v16.26,20.57
  Bottom 0.203: v16.26,20.57 16,20.83 14.22,20.83 12.7,22.35 6.6,22.35 5.59,23.37 4.57,23.37 3.81,24.13 3.05,24.13 2.39,23.47 1.67,23.47 1.27,23.88 JP3.4
PARTICLE_TX  (via drill 0.2)
  Top 0.203: U6.63 15.95,21.28 v16.13,21.46
  Bottom 0.203: v16.13,21.46 14.1,21.46 12.83,22.73 6.73,22.73 5.71,23.75 4.7,23.75 3.43,25.02 2.67,25.02 2.29,25.4 2.29,26.16 JP3.3
PARTICLE_WKP
  Top 0.203: 2.03,22.1 JP3.5 1.27,21.29 2.54,20.02 2.54,19.56 2.79,19.3 6.12,19.3 U6.22
RED_LED  (via drill 0.2)
  Top 0.203: v11.18,11.05 11.18,12.83 11.42,13.07 U6.42 | 15.88,12.95 R3.1 15.82,12.95 v15.24,12.37
  Bottom 0.203: v15.24,12.37 15.24,12.06 14.38,11.2 14.38,10.25 13.73,9.6 11.71,9.6 11.18,10.13 v11.18,11.05
SAM4L_SWDCLK  (via drill 0.2)
  Top 0.203: J2.4 5.97,6.99 6.48,7.49 6.48,8.51 7.37,9.4 v7.37,9.65 7.72,10.01 R11.1 | U6.9 10.42,22.09 10.92,21.59 v11.3,21.59
  Bottom 0.203: v7.37,9.65 7.37,11.43 8.51,12.57 9.27,12.57 9.78,13.08 10.79,13.08 11.18,13.46 11.18,14.48 11.68,14.99 12.95,16.26 12.95,19.94 v11.3,21.59
SAM4L_SWDIO  (via drill 0.2)
  Top 0.203: U6.10 9.92,21.83 v10.16,21.59 | J2.2 6.48,9.27 v6.48,9.65 6.71,9.88 R10.1
  Bottom 0.203: v6.48,9.65 6.99,10.16 6.99,11.56 8.51,13.08 9.14,13.08 9.65,13.59 10.41,13.59 10.79,13.97 10.79,14.61 10.16,15.24 9.4,15.24 8.51,16.13 8.51,19.94 v10.16,21.59
SAM4L_XIN1
  Top 0.203: U6.1 14.97,23.11 15.67,23.11 X2.3 16.76,23.73 C2.1
SAM4L_XOUT1
  Top 0.203: U6.2 13.92,23.06 14.22,23.37 14.22,25.07 X2.1 | 14.97,25.92 X2.1 | C3.1 13.54,26.42 14.37,26.42 X2.1
SENSORS_SCL  (via drill 0.2)
  Top 0.203: U3.5 4.32,13.41 4.01,13.72 3.73,13.72 3.59,13.86 3.59,14.59 3.71,14.71 4.12,14.71 v4.57,15.16 | v8.13,21.59 8.38,21.84 8.64,21.84 8.92,22.13 U6.12 8.92,23.21 8.13,24 4.79,24 U7.6 3.62,24.65 R7.1 | v14.73,31.5 14.61,31.38 U2.4
  Route15 0.203: v8.13,21.59 8.13,22.48 10.16,24.51 10.79,24.51 11.68,25.4 11.68,29.59 12.95,30.86 12.95,31.18 13.52,31.75 14.48,31.75 v14.73,31.5
  Bottom 0.203: v4.57,15.16 5.03,15.57 5.84,15.57 6.45,16.18 7.42,16.18 7.67,16.43 7.67,21.13 v8.13,21.59 | v14.73,31.5 14.73,31.7 TP7.TP
SENSORS_SDA  (via drill 0.2)
  Top 0.203: U3.6 3.23,13.71 3.23,14.69 4.18,15.63 | 4.18,15.63 4.29,15.75 4.83,15.75 5.31,15.27 v5.31,15.01 | v9.27,21.59 9.42,21.74 U6.11 9.42,23.22 8.26,24.38 7.31,24.38 U7.1 | R6.1 3.81,16 4.18,15.63 | v13.72,31.11 U2.6
  Route15 0.203: v9.27,21.59 9.27,23.11 10.29,24.13 10.92,24.13 12.06,25.27 12.06,29.46 v13.72,31.11
  Bottom 0.203: v5.31,15.01 5.99,15.01 6.73,15.75 7.52,15.75 8.05,16.28 8.05,20.37 v9.27,21.59 | v13.72,31.11 13.72,32.69 TP6.TP
VCC  (via drill 0.2)
  Top 0.203: U1.12 8.01,29.46 7.75,29.72 7.99,29.96 U1.11 8.26,30.09 v7.87,30.48 | U6.52 15.23,15.75 v16,15.75 | C20.1 v16,15.75 | v9.4,11.43 9.58,11.61 C19.1 9.58,12.5 9.92,12.84 U6.39 | U5.12 v16.84,9.48 16.84,9.68 C12.1 | D1.1 16.08,15.67 v16,15.75 | U6.61 15.78,20.28 16.26,19.81 16.76,19.81 | 16.76,19.81 17.09,20.14 C21.1 | 16.76,19.81 v17.02,19.56 | v4.83,10.87 4.52,10.87 3.7,10.05 3.7,8.75 J2.1 | U6.35 7.92,11.58 R11.2 R10.2 C14.1 5.33,11.38 v4.83,10.87 | v4.83,10.87 4.37,10.87 3.82,11.42 U3.1 | R8.2 5.08,14.22 v5.61,13.69 | 3.68,27.81 C24.1 3.23,27.41 R7.2 3.48,25.65 U7.5 | U6.8 10.92,23.37 v10.79,23.5 | v4.83,17.14 4.12,17.86 FB1.2 R6.2 | v8.13,27.18 8.76,26.54 8.76,26.04 8.2,25.48 C13.1 | U1.20 11.16,26.18 v11.18,26.16 | C17.1 R12.2 18.98,32.33 JP4.12 18.14,32.26 17.53,31.64 | U2.1 17.53,31.64 | v9.91,4.45 10.14,4.68 U5.35 | v9.91,4.45 10.07,4.28 U5.36 | U2.14 17.15,28.33 17.53,28.7 17.53,31.64 | LED1.A 15.86,1.59 16.66,2.39 C11.1 | C6.1 10.03,4.32 v9.91,4.45 | v17.65,2.29 17.53,2.41 C11.1 | C11.1 16.84,2.59 U5.1
  Top 0.406: v3.81,29.97 3.93,29.85 U4.5 3.63,28.72 C24.1
  Route15 0.203: v16.84,9.48 16.81,9.48
  Bottom 0.203: v4.83,10.87 5.15,10.87 5.97,10.05 5.97,8.75 5.48,8.26 J3.1
  pour Route15: 9.27,0 9.27,5 0,5 0,36.58 20.32,36.58 20.32,3.05 18.8,0

### Text on the board
tPlace: RESET | A | SAM4L | Hail
bPlace: RESET BUTTON | USER BUTTON | SENSORS_SCL | SENSORS_SDA | FTDI_OUT | FTDI_IN | ACC_INT2 | !FTDI_RTS | NRF_RTS | ACC_INT1 | NRF_CTS | NRF_OUT | NRF_INT | !LIGHT_INT | NRF_IN | NRF JTAG | Ghena | A | 12-2016